# Altium schematic sheet 3_downstream_con.SchDoc
size A
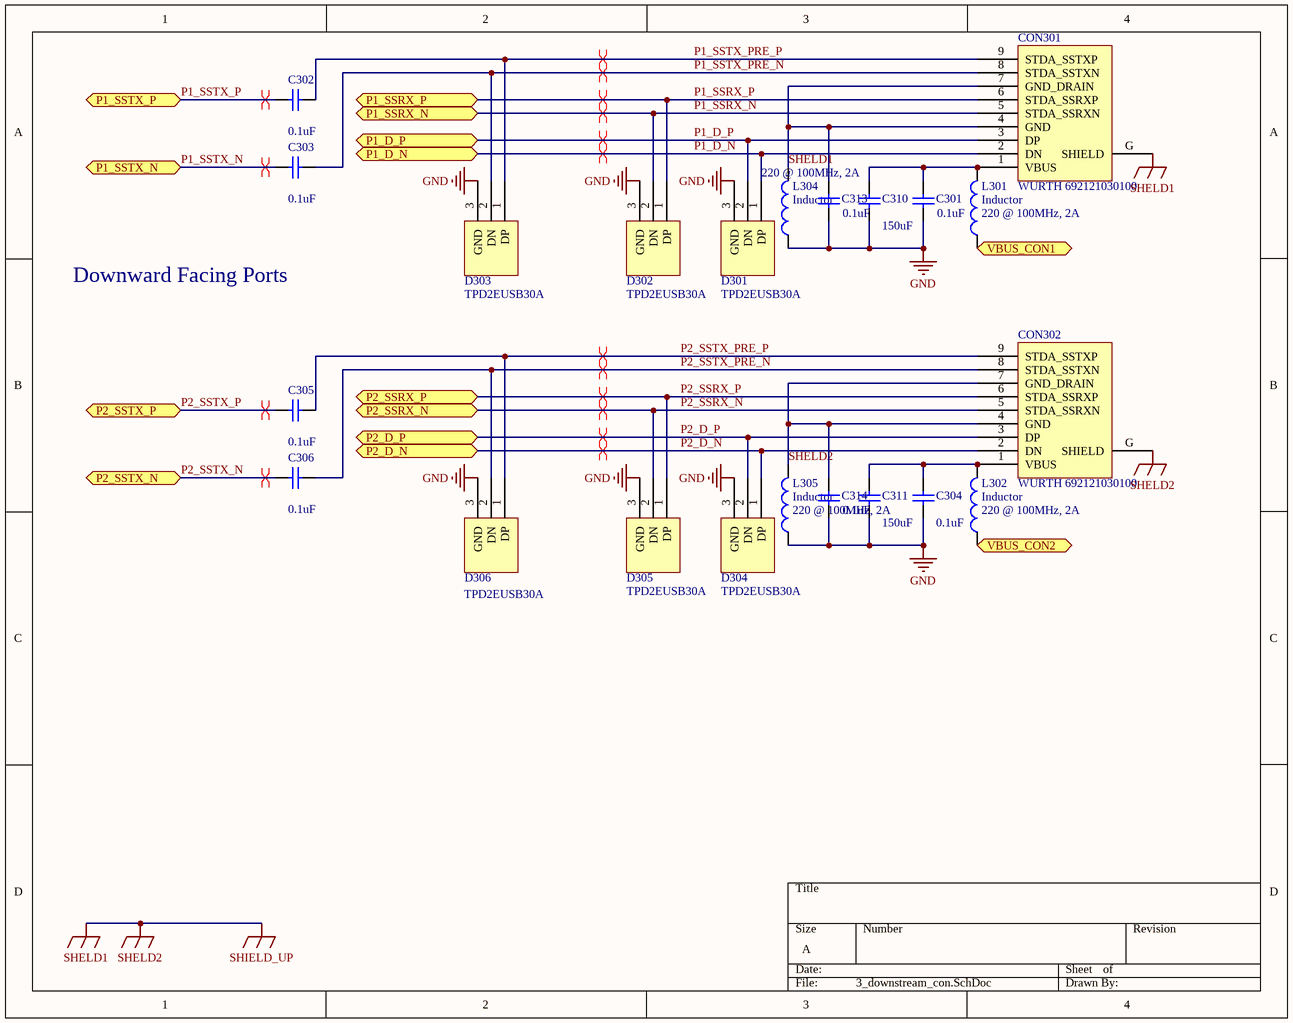
[diagram p0: 3_downstream_con.SchDoc]

## Parts
C301  value 0.1uF  [C0603[1608]]
C302  value 0.1uF  [C0402[1005]]
C303  value 0.1uF  [C0402[1005]]
C304  value 0.1uF  [C0603[1608]]
C305  value 0.1uF  [C0402[1005]]
C306  value 0.1uF  [C0402[1005]]
C310  value 150uF  [C_9G_9H]
C311  value 150uF  [C_9G_9H]
C313  value 0.1uF  [C0603[1608]]  (no BOM)
C314  value 0.1uF  [C0603[1608]]  (no BOM)
CON301  WURTH 692121030100  [WURTH 692122030100]
CON302  WURTH 692121030100  [WURTH 692122030100]
D301  TPD2EUSB30A  [TPD2EUSB30A]
D302  TPD2EUSB30A  [TPD2EUSB30A]
D303  TPD2EUSB30A  [TPD2EUSB30A]
D304  TPD2EUSB30A  [TPD2EUSB30A]
D305  TPD2EUSB30A  [TPD2EUSB30A]
D306  TPD2EUSB30A  [TPD2EUSB30A]
L301  Inductor  value 220 @ 100MHz, 2A  [L0603[1608]]
L302  Inductor  value 220 @ 100MHz, 2A  [L0603[1608]]
L304  Inductor  value 220 @ 100MHz, 2A  [L0603[1608]]
L305  Inductor  value 220 @ 100MHz, 2A  [L0603[1608]]

## Ports
P1_D_N, P1_D_P, P1_SSRX_N, P1_SSRX_P, P1_SSTX_N, P1_SSTX_P, P2_D_N, P2_D_P, P2_SSRX_N, P2_SSRX_P, P2_SSTX_N, P2_SSTX_P, VBUS_CON1, VBUS_CON2

## Nets
GND: C301.1 C304.1 C310.1 C311.1 C313.1 C314.1 D301.3(GND) D302.3(GND) D303.3(GND) D304.3(GND) D305.3(GND) D306.3(GND) L304.1 L305.1
SHELD1: C313.2 C314.2 CON301.4(GND) CON301.7(GND_DRAIN) CON301.G(SHIELD) CON302.4(GND) CON302.7(GND_DRAIN) CON302.G(SHIELD) L304.2 L305.2  [also labelled SHELD2, SHIELD_UP]
P1_D_N: CON301.2(DN) D301.1(DP) ; port P1_D_N
P1_D_P: CON301.3(DP) D301.2(DN) ; port P1_D_P
P1_SSRX_N: CON301.5(STDA_SSRXN) D302.2(DN) ; port P1_SSRX_N
P1_SSRX_P: CON301.6(STDA_SSRXP) D302.1(DP) ; port P1_SSRX_P
P1_SSTX_N: C303.2 ; port P1_SSTX_N
P1_SSTX_P: C302.2 ; port P1_SSTX_P
P1_SSTX_PRE_N: C303.1 CON301.8(STDA_SSTXN) D303.2(DN)
P1_SSTX_PRE_P: C302.1 CON301.9(STDA_SSTXP) D303.1(DP)
P2_D_N: CON302.2(DN) D304.1(DP) ; port P2_D_N
P2_D_P: CON302.3(DP) D304.2(DN) ; port P2_D_P
P2_SSRX_N: CON302.5(STDA_SSRXN) D305.2(DN) ; port P2_SSRX_N
P2_SSRX_P: CON302.6(STDA_SSRXP) D305.1(DP) ; port P2_SSRX_P
P2_SSTX_N: C306.1 ; port P2_SSTX_N
P2_SSTX_P: C305.1 ; port P2_SSTX_P
P2_SSTX_PRE_N: C306.2 CON302.8(STDA_SSTXN) D306.2(DN)
P2_SSTX_PRE_P: C305.2 CON302.9(STDA_SSTXP) D306.1(DP)
VBUS_CON1: L301.1 ; port VBUS_CON1
VBUS_CON2: L302.1 ; port VBUS_CON2
NetC301_2: C301.2 C310.2 CON301.1(VBUS) L301.2
NetC304_2: C304.2 C311.2 CON302.1(VBUS) L302.2

## Layout directives
differential pair: P1_D_N, P1_D_P, P1_SSRX_N, P1_SSRX_P, P1_SSTX_N, P1_SSTX_P, P1_SSTX_PRE_N, P1_SSTX_PRE_P, P2_D_N, P2_D_P, P2_SSRX_N, P2_SSRX_P, P2_SSTX_N, P2_SSTX_P, P2_SSTX_PRE_N, P2_SSTX_PRE_P

## Notes on the sheet
- Downward Facing Ports

## Library data of the parts
C301 C304 C313 C314 = Cap: Capacitor; MFG: KEMET; MFGPN: C0603C104M5RACTU; Version: 0603 imperial
C302 C303 C305 C306 = Cap: Capacitor; MFG: KEMET; MFGPN: C0402C104K8PACTU; Version: 0402 imperial
C310 C311 = Cap: Capacitor; MFG: United Chemi-Con; MFGPN: EMVA100ADA151MF55G; Version: SMD - 9G or 9H
CON301 CON302 = WURTH 692121030100: MFGPN: 692122030100; MFG: Wurth Electronics Inc
D301-D305 = TPD2EUSB30A: MFG: Texas Instruments; MFGPN: TPD2EUSB30ADRTR
D306 = TPD2EUSB30A: MFGPN: TPD2EUSB30ADRTR; MFG: Texas Instruments
L301 L302 L304 L305 = Inductor: MFG: Murata Electronics North America; MFGPN: BLM18KG221SN1D; Version: 0603 imperial